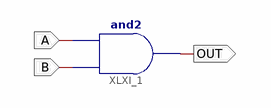
[diagram p0: schematic sheet 1]
// Xilinx ISE schematic test.sch (spartan3) as structural Verilog: 1 symbols, 3 ports
module test (
  input  A,
  input  B,
  output OUT
);

  and XLXI_1 (OUT, B, A);
endmodule
